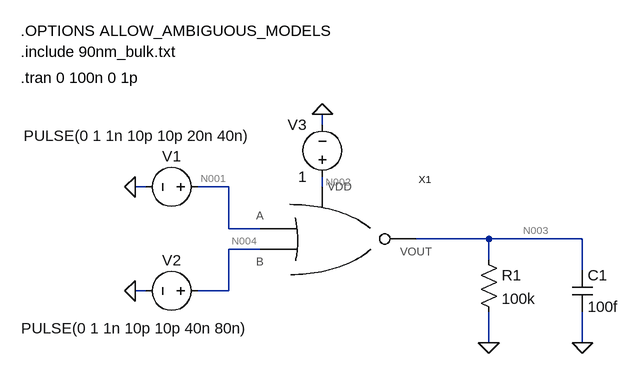
[diagram p0: schematic nor_tests.asc]
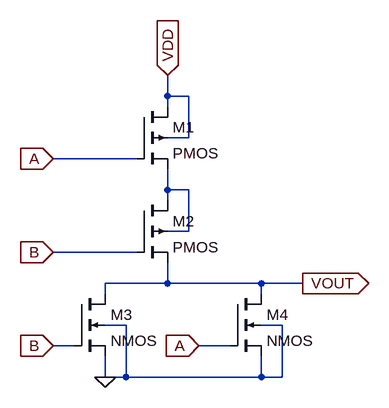
[diagram p1: sub-circuit nor.asc]
nor_tests.asc, the LTspice schematic file:
Version 4.1
SHEET 1 880 680
WIRE 208 64 208 48
WIRE -64 160 -80 160
WIRE 64 160 16 160
WIRE 208 160 208 144
WIRE 64 224 64 160
WIRE 112 224 64 224
WIRE 464 240 352 240
WIRE 608 240 464 240
WIRE 112 256 64 256
WIRE 464 272 464 240
WIRE 608 288 608 240
WIRE -64 320 -80 320
WIRE 64 320 64 256
WIRE 64 320 16 320
WIRE 464 400 464 352
WIRE 608 400 608 352
FLAG 608 400 0
FLAG 464 400 0
FLAG 208 48 0
FLAG -80 160 0
FLAG -80 320 0
SYMBOL nor 224 240 R0
SYMATTR InstName X1
SYMBOL voltage 208 160 R180
WINDOW 0 24 96 Left 2
WINDOW 3 24 16 Left 2
WINDOW 123 0 0 Left 0
WINDOW 39 0 0 Left 0
SYMATTR InstName V3
SYMATTR Value 1
SYMBOL res 448 256 R0
SYMATTR InstName R1
SYMATTR Value 100k
SYMBOL cap 592 288 R0
SYMATTR InstName C1
SYMATTR Value 100f
SYMBOL voltage 32 160 R90
WINDOW 0 -32 56 VBottom 2
WINDOW 3 -94 108 VTop 2
WINDOW 123 0 0 Left 0
WINDOW 39 0 0 Left 0
SYMATTR InstName V1
SYMATTR Value PULSE(0 1 1n 10p 10p 20n 40n)
SYMBOL voltage 32 320 R90
WINDOW 0 -32 56 VBottom 2
WINDOW 3 42 112 VTop 2
WINDOW 123 0 0 Left 0
WINDOW 39 0 0 Left 0
SYMATTR InstName V2
SYMATTR Value PULSE(0 1 1n 10p 10p 40n 80n)
TEXT -256 -48 Left 2 !.include 90nm_bulk.txt
TEXT -256 -8 Left 2 !.tran 0 100n 0 1p
TEXT -256 -80 Left 2 !.OPTIONS ALLOW_AMBIGUOUS_MODELS

nor.asc, the sub-circuit schematic file:
Version 4.1
SHEET 1 1028 680
WIRE 272 80 272 48
WIRE 304 80 272 80
WIRE 272 96 272 80
WIRE 304 144 304 80
WIRE 304 144 272 144
WIRE 224 176 96 176
WIRE 272 224 272 192
WIRE 304 224 272 224
WIRE 272 240 272 224
WIRE 304 288 304 224
WIRE 304 288 272 288
WIRE 224 320 96 320
WIRE 272 368 272 336
WIRE 272 368 176 368
WIRE 416 368 272 368
WIRE 480 368 416 368
WIRE 176 384 176 368
WIRE 416 384 416 368
WIRE 208 432 176 432
WIRE 448 432 416 432
WIRE 128 464 96 464
WIRE 368 464 320 464
WIRE 176 512 176 480
WIRE 208 512 208 432
WIRE 208 512 176 512
WIRE 416 512 416 480
WIRE 416 512 208 512
WIRE 448 512 448 432
WIRE 448 512 416 512
FLAG 96 176 A
IOPIN 96 176 In
FLAG 272 48 VDD
IOPIN 272 48 In
FLAG 96 320 B
IOPIN 96 320 In
FLAG 480 368 VOUT
IOPIN 480 368 Out
FLAG 176 512 0
FLAG 320 464 A
IOPIN 320 464 In
FLAG 96 464 B
IOPIN 96 464 In
SYMBOL pmos4 224 96 R0
SYMATTR InstName M1
SYMATTR Value2 l=90n w=400n
SYMBOL pmos4 224 240 R0
SYMATTR InstName M2
SYMATTR Value2 l=90n w=400n
SYMBOL nmos4 368 384 R0
SYMATTR InstName M4
SYMATTR Value2 l=90n w=200n
SYMBOL nmos4 128 384 R0
SYMATTR InstName M3
SYMATTR Value2 l=90n w=200n

The netlist it stands for:
* nor_tests.asc
X§X1 N001 N004 N002 N003 nor
V3 N002 0 1
R1 N003 0 100k
C1 N003 0 100f
V1 N001 0 PULSE(0 1 1n 10p 10p 20n 40n)
V2 N004 0 PULSE(0 1 1n 10p 10p 40n 80n)

* block symbol definitions
.subckt nor A B VDD VOUT
M1 VDD A N001 VDD PMOS l=90n w=400n
M2 N001 B VOUT N001 PMOS l=90n w=400n
M4 VOUT A 0 0 NMOS l=90n w=200n
M3 VOUT B 0 0 NMOS l=90n w=200n
.ends nor

.model NMOS NMOS
.model PMOS PMOS
.lib standard.mos
.include 90nm_bulk.txt
.tran 0 100n 0 1p
.OPTIONS ALLOW_AMBIGUOUS_MODELS
.backanno
.end

* Results of the author's LTspice run, read from the files saved beside the schematic
* Operating Point, zero values left out:
*   V(n002) = 1 V
*   V(n003) = 861.2 mV
*   I(R1) = 8.612 µA
*   I(V3) = -8.612 µA
*   Ix(x1:vdd) = 8.612 µA
*   Ix(x1:vout) = -8.612 µA
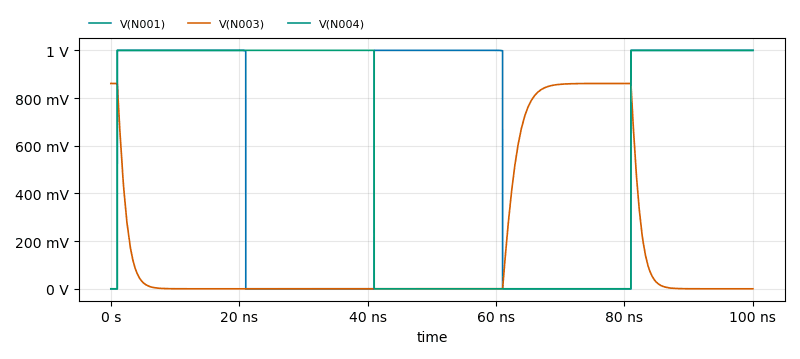
[diagram p2: Transient Analysis of nor_tests.asc, plotted from the saved traces]
* Transient Analysis, 1 run:
*   V(N001): min 0 V, max 1 V, average 590.1 mV, rms 768.2 mV, last 1 V
*   V(N003): min 0 V, max 861.2 mV, average 186.3 mV, rms 381.2 mV, last 0 V
*   V(N004): min 0 V, max 1 V, average 590.1 mV, rms 768.1 mV, last 1 V